# Altium schematic sheet [03]-Python_Camera_Interface.SchDoc
size A4
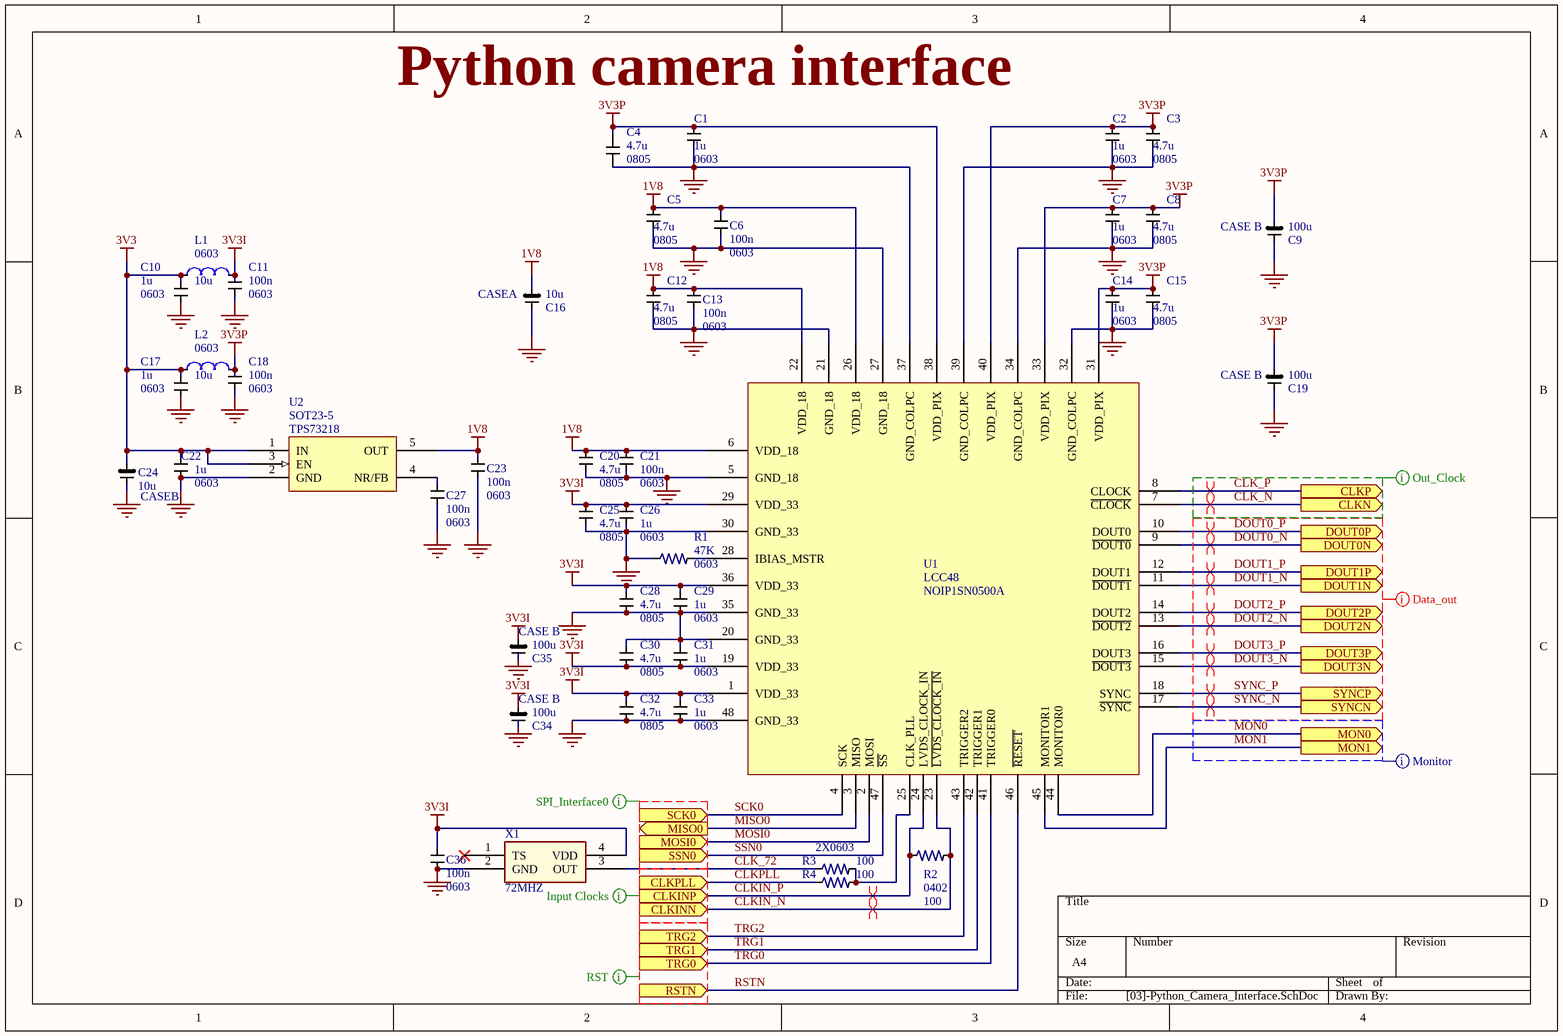
[diagram p0: [03]-Python_Camera_Interface.SchDoc]

## Parts
C1  1u  PCB Layer:: 0603  [*0603]
C2  1u  PCB Layer:: 0603  [*0603]
C3  4.7u  PCB Package: 0805  [*CAPC2013X140N]
C4  4.7u  PCB Package: 0805  [*CAPC2013X140N]
C5  4.7u  PCB Package: 0805  [*CAPC2013X140N]
C6  100n  PCB package type: 0603  [*CAPC1608X90N]
C7  1u  PCB Layer:: 0603  [*0603]
C8  4.7u  PCB Package: 0805  [*CAPC2013X140N]
C9  100u  CASE: CASE B  [CAPC3529X21N]
C10  1u  PCB size: 0603
C11  100n  PCB package type: 0603  [*CAPC1608X90N]
C12  4.7u  PCB Package: 0805  [*CAPC2013X140N]
C13  100n  PCB package type: 0603  [*CAPC1608X90N]
C14  1u  PCB Layer:: 0603  [*0603]
C15  4.7u  PCB Package: 0805  [*CAPC2013X140N]
C16  10u  CASE Type:: CASEA  [CAPCP3216X18N]
C17  1u  PCB size: 0603
C18  100n  PCB package type: 0603  [*CAPC1608X90N]
C19  100u  CASE: CASE B  [CAPC3529X21N]
C20  4.7u  PCB Package: 0805  [*CAPC2013X140N]
C21  100n  PCB package type: 0603  [*CAPC1608X90N]
C22  1u  PCB Layer:: 0603  [*0603]
C23  100n  PCB package type: 0603  [*CAPC1608X90N]
C24  10u  PCB layer: CASEB  [CAPC3528X21N]
C25  4.7u  PCB Package: 0805  [*CAPC2013X140N]
C26  1u  PCB Layer:: 0603  [*0603]
C27  100n  PCB package type: 0603  [*CAPC1608X90N]
C28  4.7u  PCB Package: 0805  [*CAPC2013X140N]
C29  1u  PCB Layer:: 0603  [*0603]
C30  4.7u  PCB Package: 0805  [*CAPC2013X140N]
C31  1u  PCB Layer:: 0603  [*0603]
C32  4.7u  PCB Package: 0805  [*CAPC2013X140N]
C33  1u  PCB Layer:: 0603  [*0603]
C34  100u  CASE: CASE B  [CAPC3529X21N]
C35  100u  CASE: CASE B  [CAPC3529X21N]
C36  100n  PCB package type: 0603  [*CAPC1608X90N]
L1  10u  PCB Layout:: 0603  [*INDC1608X95N]
L2  10u  PCB Layout:: 0603  [*INDC1608X95N]
R1  47K  foot print: 0603  [*0603]
R2  100  PCB footprint: 0402  [*R0402]
R3  100  foot print: 2X0603  [*0603]
R4  100  [*0603]
U1  NOIP1SN0500A  package type: LCC48  [LCC101P1430X1430X228-48N]
U2  TPS73218  PCB Footprint type:: SOT23-5  [*SOT95P280X145-5N]
X1  72MHZ  [OSCSC320X250X100N]

## Ports
CLKINN (in), CLKINP (in), CLKN (out), CLKP (out), CLKPLL (in), DOUT0N (out), DOUT0P (out), DOUT1N (out), DOUT1P (out), DOUT2N (out), DOUT2P (out), DOUT3N (out), DOUT3P (out), MISO0 (out), MON0 (out), MON1 (out), MOSI0 (in), RSTN (in), SCK0 (in), SSN0 (in), SYNCN (out), SYNCP (out), TRG0 (in), TRG1 (in), TRG2 (in)

## Nets
1V8: C5.2 C6.2 C12.2 C13.2 C16.1 C20.2 C21.2 C23.2 U1.6(VDD_18) U1.22(VDD_18) U1.26(VDD_18) U2.5(OUT)
3V3: C10.2 C17.2 C22.2 C24.1 L1.1 L2.1 U2.1(IN) U2.3(EN)
3V3I: C11.2 C25.2 C26.2 C28.2 C29.2 C30.1 C31.1 C32.2 C33.2 C34.1 C35.1 C36.2 L1.2 U1.1(VDD_33) U1.19(VDD_33) U1.29(VDD_33) U1.36(VDD_33) X1.4(VDD)
3V3P: C1.2 C2.2 C3.2 C4.1 C7.2 C8.2 C9.1 C14.2 C15.2 C18.2 C19.1 L2.2 U1.31(VDD_PIX) U1.33(VDD_PIX) U1.38(VDD_PIX) U1.40(VDD_PIX)
GND: C1.1 C2.1 C3.1 C4.2 C5.1 C6.1 C7.1 C8.1 C9.2 C10.1 C11.1 C12.1 C13.1 C14.1 C15.1 C16.2 C17.1 C18.1 C19.2 C20.1 C21.1 C22.1 C23.1 C24.2 C25.1 C26.1 C27.1 C28.1 C29.1 C30.2 C31.2 C32.1 C33.1 C34.2 C35.2 C36.1 R1.1 U1.5(GND_18) U1.20(GND_33) U1.21(GND_18) U1.27(GND_18) U1.30(GND_33) U1.32(GND_COLPC) U1.34(GND_COLPC) U1.35(GND_33) U1.37(GND_COLPC) U1.39(GND_COLPC) U1.48(GND_33) U2.2(GND) X1.2(GND)
CLK_72: R3.1 X1.3(OUT)
CLK_N: U1.7(~{CLOCK}) ; port CLKN
CLK_P: U1.8(CLOCK) ; port CLKP
CLKIN_N: R2.2 U1.23(~{LVDS_CLOCK_}~{IN}) ; port CLKINN
CLKIN_P: R2.1 U1.24(LVDS_CLOCK_IN) ; port CLKINP
CLKPLL: R4.1 ; port CLKPLL
DOUT0_N: U1.9(~{DOUT0}) ; port DOUT0N
DOUT0_P: U1.10(DOUT0) ; port DOUT0P
DOUT1_N: U1.11(~{DOUT1}) ; port DOUT1N
DOUT1_P: U1.12(DOUT1) ; port DOUT1P
DOUT2_N: U1.13(~{DOUT2}) ; port DOUT2N
DOUT2_P: U1.14(DOUT2) ; port DOUT2P
DOUT3_N: U1.15(~{DOUT3}) ; port DOUT3N
DOUT3_P: U1.16(DOUT3) ; port DOUT3P
MISO0: U1.3(MISO) ; port MISO0
MON0: U1.44(MONITOR0) ; port MON0
MON1: U1.45(MONITOR1) ; port MON1
MOSI0: U1.2(MOSI) ; port MOSI0
RSTN: U1.46(~{RESET}) ; port RSTN
SCK0: U1.4(SCK) ; port SCK0
SSN0: U1.47(~{SS}) ; port SSN0
SYNC_N: U1.17(~{SYNC}) ; port SYNCN
SYNC_P: U1.18(SYNC) ; port SYNCP
TRG0: U1.41(TRIGGER0) ; port TRG0
TRG1: U1.42(TRIGGER1) ; port TRG1
TRG2: U1.43(TRIGGER2) ; port TRG2
NetC27_2: C27.2 U2.4(NR/FB)
NetR1_2: R1.2 U1.28(IBIAS_MSTR)
NetR3_2: R3.2 R4.2 U1.25(CLK_PLL)

Not connected (* = marked no-connect by the designer): X1 1(TS)*

## Layout directives
differential pair: CLK_N, CLK_P, CLKIN_N, CLKIN_P, DOUT0_N, DOUT0_P, DOUT1_N, DOUT1_P, DOUT2_N, DOUT2_P, DOUT3_N, DOUT3_P, SYNC_N, SYNC_P
mark named Out_Clock: CLK_N, CLK_P
mark named Data_out: DOUT0_N, DOUT0_P, DOUT1_N, DOUT1_P, DOUT2_N, DOUT2_P, DOUT3_N, DOUT3_P, SYNC_N, SYNC_P
mark named Monitor: MON0, MON1
mark named RST: (no net found under the mark)
mark named Input Clocks: CLKIN_P
mark named SPI_Interface0: (no net found under the mark)

## Notes on the sheet
- Python camera interface

## Library data of the parts
C1-C36 L1 L2 U2 = Component_1
  C1 C2 C7 C14 C22 C26 C29 C31 C33: Buying URL:: https://uk.farnell.com/avx/0603yc105kat2a/cap-1-f-16v-10-x7r-0603/dp/1658870RL?st=1u%200603
  C3-C5 C8 C12 C15 C20 C25 C28 C30 C32: Buying URL:: https://uk.farnell.com/avx/08053d475kat2a/cap-4-7-f-25v-10-x5r-0805/dp/1657932?st=4.7u%200805
  C6 C11 C13 C18 C21 C23 C27 C36: Buying URL:: https://uk.farnell.com/murata/grm188r71h104ka93d/cap-0-1-f-50v-10-x7r-0603-reel/dp/2408527?st=GRM188R71H104KA93D
  C9 C19 C34 C35: Buying URL:: https://uk.farnell.com/avx/tajb107k006tnj/cap-tant-aec-q200-100uf-6-3v-case/dp/2893386?st=100u%20CASE%20B
  C10 C17: Buying URL: https://uk.farnell.com/avx/0402zd105kat2a/cap-1-f-10v-10-x5r-0402/dp/1740588?st=1u%20capsitor
  C16: buying URL:: https://uk.farnell.com/kemet/t491a106m004at/cap-tantalum-10uf-4v-case-a/dp/2676170?st=T491A106M004AT
  L1 L2: Buying URL:: https://uk.farnell.com/tdk/mlz1608m100wt/inductor-10uh-20-shielded/dp/2215635?st=10uH%200603
  U2: Buying URL:: https://uk.farnell.com/texas-instruments/tps73218dbvt/ldo-fixed-1-8v-150ma-sot-23-5/dp/2323599RL?st=TPS73218
R1 R3 = RP73D1J76R8BTDG: Res Thin Film 0603 76.8 Ohm 0.1% 1/10W Â±15ppm/Â°C Molded SMD Paper T/R; MF: TE Connectivity / Holsworthy; Design by: Faheem; Price: None; MP: RP73D1J76R8BTDG; Package: 0603 TE Connectivity / AMP; SnapEDA_Link: https://www.snapeda.com/parts/RP73D1J76R8BTDG/TE%20Connectivity%20/%20Holsworthy/view-part/?ref=snap; Value: *; Buying URL:: https://uk.farnell.com/vishay/crcw060347k0fkea/res-47k-1-0-1w-0603-thick-film/dp/1469811?st=47K%200603; Availability: Unavailable
R2 = RP73D1J76R8BTDG: Res Thin Film 0603 76.8 Ohm 0.1% 1/10W Â±15ppm/Â°C Molded SMD Paper T/R; Buying URL:: https://uk.farnell.com/yageo/rc0402fr-07100rl/res-100r-1-0-0625w-0402-thick/dp/9239111
R4 = RP73D1J76R8BTDG: Res Thin Film 0603 76.8 Ohm 0.1% 1/10W Â±15ppm/Â°C Molded SMD Paper T/R; MF: TE Connectivity / Holsworthy; Design by: Faheem; foot print: 0603; Price: None; MP: RP73D1J76R8BTDG; Package: 0603 TE Connectivity / AMP; SnapEDA_Link: https://www.snapeda.com/parts/RP73D1J76R8BTDG/TE%20Connectivity%20/%20Holsworthy/view-part/?ref=snap; Value: *; Buying URL:: https://uk.farnell.com/vishay/crcw060347k0fkea/res-47k-1-0-1w-0603-thick-film/dp/1469811?st=47K%200603; Availability: Unavailable
U1 = Component_1: Python camera sensor. Having pixel output of 500 by 600.; Part No.: NOIP1SN0500A-QDI; Manufactured by: OnSemi; Designer: Faheem; Company: PhasePhotonics; Data Sheet URL:: https://www.onsemi.com/pub/Collateral/NOIP1SN1300A-D.PDF; Buying URL:: https://uk.farnell.com/on-semiconductor/noip1sn0500a-qdi/image-sensor-rbg-800-x-600-lcc/dp/2727907?ost=NOIP1SN0500A&ddkey=https%3Aen-GB%2FElement14_United_Kingdom%2Fsearch; Package Type: LCC. required LCC socket as well.; Date Created: 04/02/2019; PCB footprint download: https://www.snapeda.com/parts/NOIP1SN0500A-QDI/ON%20Semiconductor/view-part/?ref=search&t=NOIP1SN0500A; 3D Model: http://www.3dcontentcentral.com/secure/download-model.aspx?catalogid=171&id=343978
X1 = Component_1: mf_part no.: ASFLMB-72.000MHZ-XY-T; Manufactured by: ABRACON